# Altium schematic sheet main_rf.SchDoc: SDL - Main
size Letter; Author: Ye-Sheng Kuo; Revision: 1; SheetNumber: 3; SheetTotal: 8
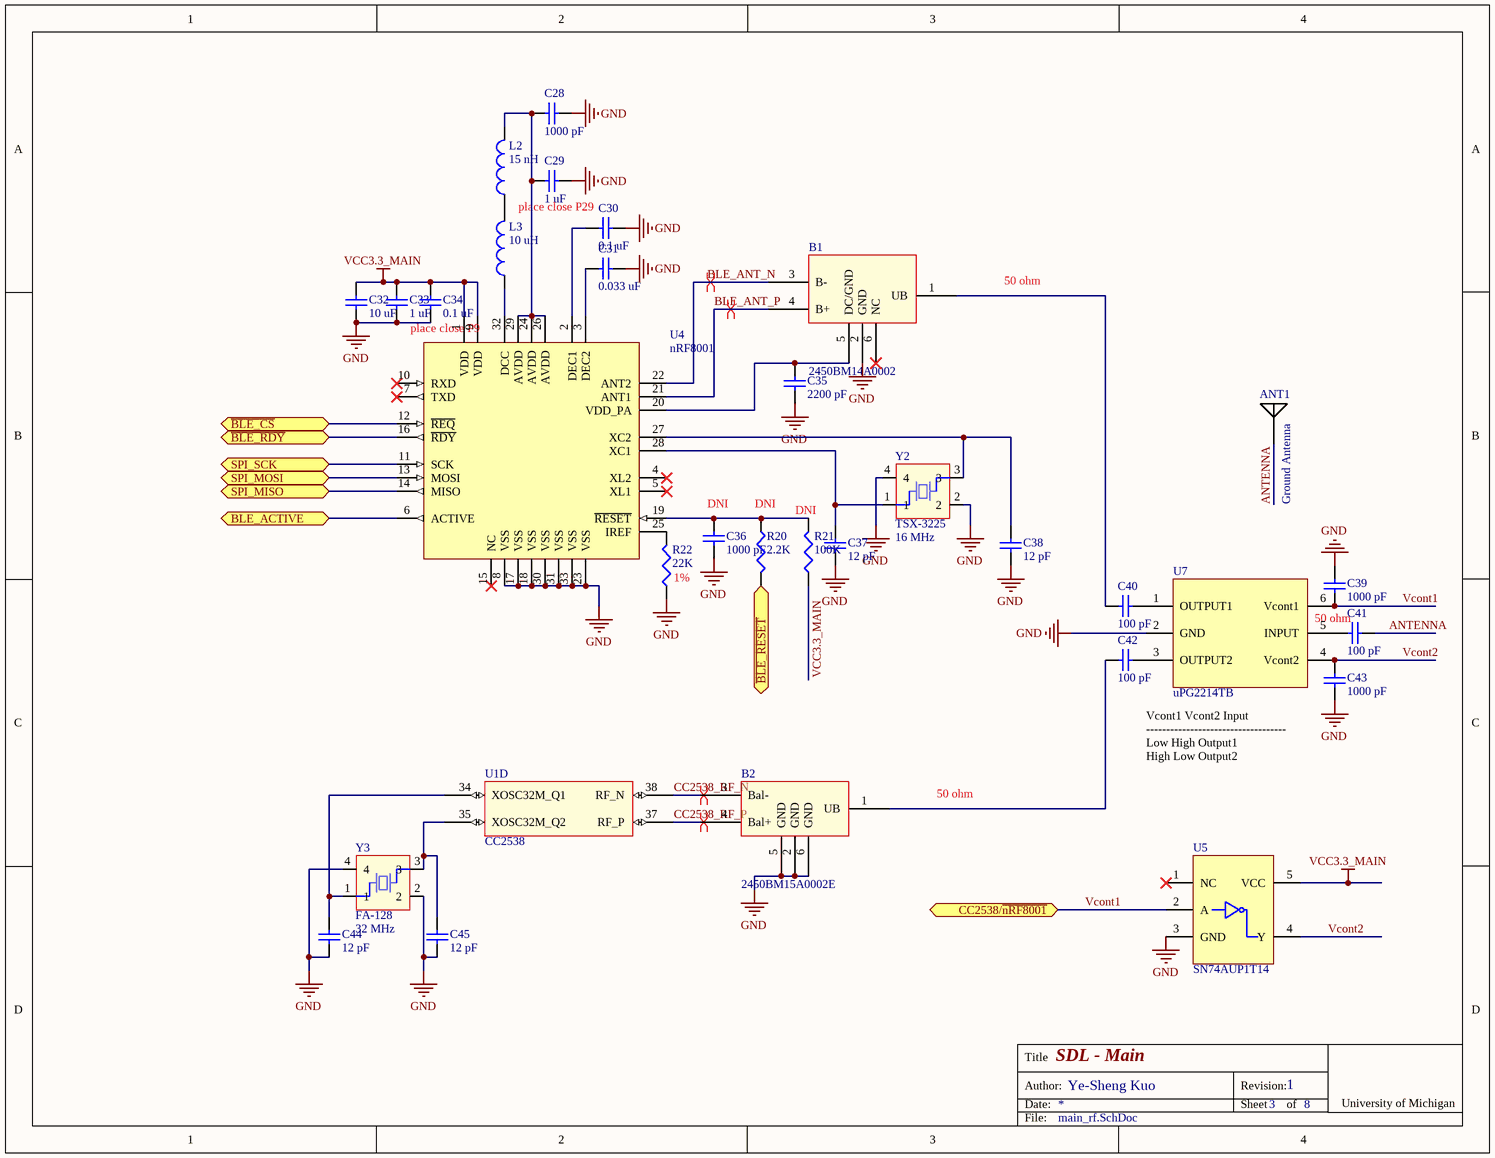
[diagram p0: main_rf.SchDoc]

## Parts
ANT1  Ground Antenna  [Chip Antenna]
B1  2450BM14A0002  [2450BM14A0002]
B2  2450BM15A0002E  [2450BM15A0002]
C28  value 1000 pF  [0402]  (hidden comment: Ceramic capacitor)
C29  value 1 uF  [0603]  (hidden comment: Ceramic capacitor)
C30  value 0.1 uF  [0402]  (hidden comment: Ceramic capacitor)
C31  value 0.033 uF  [0402]  (hidden comment: Ceramic capacitor)
C32  value 10 uF  [0603]  (hidden comment: Ceramic capacitor)
C33  value 1 uF  [0402]  (hidden comment: Ceramic capacitor)
C34  value 0.1 uF  [0402]  (hidden comment: Ceramic capacitor)
C35  value 2200 pF  [0402]  (hidden comment: Ceramic capacitor)
C36  value 1000 pF  [0402]  (hidden comment: Ceramic capacitor)
C37  value 12 pF  [0402]  (hidden comment: Ceramic capacitor)
C38  value 12 pF  [0402]  (hidden comment: Ceramic capacitor)
C39  value 1000 pF  [0402]  (hidden comment: Ceramic capacitor)
C40  value 100 pF  [0402]  (hidden comment: Ceramic capacitor)
C41  value 100 pF  [0402]  (hidden comment: Ceramic capacitor)
C42  value 100 pF  [0402]  (hidden comment: Ceramic capacitor)
C43  value 1000 pF  [0402]  (hidden comment: Ceramic capacitor)
C44  value 12 pF  [0402]  (hidden comment: Ceramic capacitor)
C45  value 12 pF  [0402]  (hidden comment: Ceramic capacitor)
L2  value 15 nH  [0402]  (hidden comment: Chip inductor)
L3  value 10 uH  [0603]  (hidden comment: Chip inductor)
R20  value 2.2K  [0402]  (hidden comment: Chip resistor)
R21  value 100K  [0402]  (hidden comment: Chip resistor)
R22  value 22K  [0402]  (hidden comment: Chip resistor)
U1  CC2538  [QFN56]  (part D of 6)
U4  nRF8001  [QFN32]
U5  SN74AUP1T14  [SC-70-5 (DCK)]
U7  uPG2214TB  [minimold-6]
Y2  TSX-3225  frequency: 16 MHz  [TSX-3225]
Y3  FA-128  frequency: 32 MHz  [FA-128]

## Ports
BLE_ACTIVE, CC2538/~{nRF8001}, SPI_MISO, SPI_MOSI, SPI_SCK, ~{BLE_CS}, ~{BLE_RDY}, ~{BLE_RESET}

## Nets
GND: B1.2(GND) B2.2(GND) B2.5(GND) B2.6(GND) C28.2 C29.2 C30.2 C31.2 C32.2 C33.2 C34.2 C35.2 C36.2 C37.2 C38.2 C39.1 C43.2 C44.1 C45.1 R22.2 U4.8(VSS) U4.17(VSS) U4.18(VSS) U4.23(VSS) U4.30(VSS) U4.31(VSS) U4.33(VSS) U5.3(GND) U7.2(GND) Y2.2 Y2.4 Y3.2 Y3.4
VCC3.3_MAIN: C32.1 C33.1 C34.1 R21.2 U4.1(VDD) U4.9(VDD) U5.5(VCC)
ANTENNA: ANT1.1 C41.2
~{BLE_CS}: U4.12(~{REQ}) ; port ~{BLE_CS}
~{BLE_RDY}: U4.16(~{RDY}) ; port ~{BLE_RDY}
~{BLE_RESET}: R20.1 ; port ~{BLE_RESET}
BLE_ACTIVE: U4.6(ACTIVE) ; port BLE_ACTIVE
BLE_ANT_N: B1.3(B-) U4.22(ANT2)
BLE_ANT_P: B1.4(B+) U4.21(ANT1)
CC2538_RF_N: B2.3(Bal-) U1.38(RF_N)
CC2538_RF_P: B2.4(Bal+) U1.37(RF_P)
SPI_MISO: U4.14(MISO) ; port SPI_MISO
SPI_MOSI: U4.13(MOSI) ; port SPI_MOSI
SPI_SCK: U4.11(SCK) ; port SPI_SCK
Vcont1: C39.2 U5.2(A) U7.6(Vcont1) ; port CC2538/~{nRF8001}
Vcont2: C43.1 U5.4(Y) U7.4(Vcont2)
NetB1_1: B1.1(UB) C40.1
NetB1_5: B1.5(DC/GND) C35.1 U4.20(VDD_PA)
NetB2_1: B2.1(UB) C42.1
NetC28_1: C28.1 C29.1 L2.1 U4.24(AVDD) U4.26(AVDD) U4.29(AVDD)
NetC30_1: C30.1 U4.2(DEC1)
NetC31_1: C31.1 U4.3(DEC2)
NetC36_1: C36.1 R20.2 R21.1 U4.19(~{RESET})
NetC37_1: C37.1 U4.28(XC1) Y2.1
NetC38_1: C38.1 U4.27(XC2) Y2.3
NetC40_2: C40.2 U7.1(OUTPUT1)
NetC41_1: C41.1 U7.5(INPUT)
NetC42_2: C42.2 U7.3(OUTPUT2)
NetC44_2: C44.2 U1.34(XOSC32M_Q1) Y3.1
NetC45_2: C45.2 U1.35(XOSC32M_Q2) Y3.3
NetL2_2: L2.2 L3.1
NetL3_2: L3.2 U4.32(DCC)
NetR22_1: R22.1 U4.25(IREF)

Not connected (* = marked no-connect by the designer): B1 6(NC)*; U4 4(XL2)* 5(XL1)* 7(TXD)* 10(RXD)* 15(NC)*; U5 1(NC)*

## Layout directives
differential pair: BLE_ANT_N, BLE_ANT_P, CC2538_RF_N, CC2538_RF_P

## Notes on the sheet
- place close P29
- 50 ohm
- place close P9
- (near C36) DNI
- (near R20) DNI
- (near R21) DNI
- (near R22) 1%
- (near C43) Vcont1	Vcont2	Input
  -----------------------------------
  Low	High	Output1
  High	Low	Output2
- Title
- Date:
- Author:
- Revision:
- Sheet
- of
- University of Michigan
- File:

## Library data of the parts
ANT1 = Ground Antenna: 2.4GHz Surface Mount Device (SMD) On Ground Antenna, 50 Ohms; Supplier 1: RichardsonRFPD; Supplier Part Number 1: FR05-S1-N-0102B
B1 = 2450BM14A0002: 2.45 GHz Balun for nRF8001; Supplier 1: Digi-Key; Supplier Part Number 1: 712-1574-1-ND
B2 = 2450BM15A0002E: 2.45 GHz Balun for TI CC253X; Supplier 1: Digi-Key; Supplier Part Number 1: 712-1536-1-ND
C28 C36 C39 C43 = C_1000p_0402_ceramic: Ceramic capacitor, 1000 pF, 0402 package; Manufacture: TDK; voltage rated: 50 V; tolerance: 10%; package: 0402; Supplier 1: Digi-Key; Supplier Part Number 1: 445-6846-1-ND
C29 = C_1u_0603_ceramic: Ceramic capacitor, 1 uF, 0603 package; Manufacture: TDK; voltage rated: 10V; tolerance: 10%; package: 0603; Supplier 1: Digi-Key; Supplier Part Number 1: 445-1321-1-ND
C30 C34 = C_0.1u_0402_ceramic: Ceramic capacitor, 0.1u, 0402 package; Manufacture: TDK; voltage rated: 10 V; tolerance: 10%; Supplier 1: Digi-Key; Supplier Part Number 1: 445-1265-1-ND; package: 0402
C31 = C_0.033u_0402_ceramic: Ceramic capacitor, 0.033 uF, 0402 package; Manufacture: TDK; voltage rated: 50 V; tolerance: 10%; Temperature Coefficient: X7R; package: 0603; Supplier 1: Digi-Key; Supplier Part Number 1: 445-7334-1-ND
C32 = C_10u_0603_ceramic: Ceramic capacitor, 10 uF, 0603 package; Manufacture: TDK; voltage rated: 6.3V; tolerance: 20%; package: 0603; Supplier 1: Digi-Key; Supplier Part Number 1: 445-4112-1-ND
C33 = C_1u_0402_ceramic: Ceramic capacitor, 1 uF, 0402 package; Manufacture: TDK; voltage rated: 6.3 V; tolerance: 10%; package: 0402; Supplier 1: Digi-Key; Supplier Part Number 1: 445-5000-1-ND
C35 = C_2200p_0402_ceramic: Ceramic capacitor, 2200 pF, 0402 package; Manufacture: TDK; voltage rated: 50 V; tolerance: 10%; Temperature Coefficient: X7R; package: 0402; Supplier 1: Digi-Key; Supplier Part Number 1: 445-1257-1-ND
C37 C38 C44 C45 = C_12p_0402_ceramic: Ceramic capacitor, 12 pF, 0402 package; Manufacture: Johanson; voltage rated: 50 V; tolerance: 2%; package: 0402; Supplier 1: Digi-Key; Supplier Part Number 1: 712-1256-1-ND
C40-C42 = C_100p_0402_ceramic: Ceramic capacitor, 100 pF, 0402 package; Manufacture: Kemet; voltage rated: 25 V; tolerance: 1%; package: 0402; Supplier 1: Digi-Key; Supplier Part Number 1: 399-11246-1-ND
L2 = L_15n_0402: Chip inductor, 15 nH, 0402 package; tolerance: 5%; package: 0402; Supplier 1: Digi-Key; Supplier Part Number 1: 712-1408-1-ND
L3 = L_10u_0603: Chip inductor, 10 uH, 0603 package; tolerance: 20%; package: 0402; Supplier 1: Digi-Key; Supplier Part Number 1: 445-3608-1-ND
R20 = R_2.2K_0402: Chip resistor, 2.2K, 0402 package; tolerance: 1%; power: 1/16 W; package: 0402; Supplier 1: Digi-Key; Supplier Part Number 1: 541-2.20KLCT-ND
R21 = R_100K_0402: Chip resistor, 100K, 0402 package; tolerance: 1%; power: 1/16 W; Supplier 1: Digi-Key; Supplier Part Number 1: 541-100KLCT-ND; package: 0402
R22 = R_22K_0402: Chip resistor, 22K, 0402 package; tolerance: 1%; power: 1/16 W; package: 0402; Supplier 1: Digi-Key; Supplier Part Number 1: 541-22.0KLCT-ND
U1 = CC2538: A Powerful System-On-Chip for 2.4-GHz IEEE 802.15.4, 6LoWPAN  and ZigBee Applications; Supplier 1: Digi-Key; Supplier Part Number 1: 296-35797-1-ND
U4 = nRF8001: Single-chip Bluetooth low energy solution; Supplier 1: Digi-Key; Supplier Part Number 1: 1490-1026-ND
U5 = SN74AUP1T14: LOW POWER, 1.8/2.5/3.3-V INPUT, 3.3-V CMOS OUTPUT, SINGLE  SCHMITT-TRIGGER INVERTER GATE; Supplier 1: Digi-Key; Supplier Part Number 1: 296-27392-1-ND
U7 = uPG2214TB: GaAs Integrated Circuit for L, S-Band SPDT Switch; Supplier 1: Digi-Key; Supplier Part Number 1: UPG2214TB-E4-ACT-ND
Y2 = TSX-3225: MHz Range Crystal Unit; Load capatance: 9 pF; ESR: 60; stability: 10 ppm; Supplier 1: Digi-Key; Supplier Part Number 1: SER3628CT-ND
Y3 = FA-128: MHz Range Crystal Unit; Load capatance: 10 pF; ESR: 60; stability: 20 ppm; Supplier 1: Digi-Key; Supplier Part Number 1: SER3800CT-ND